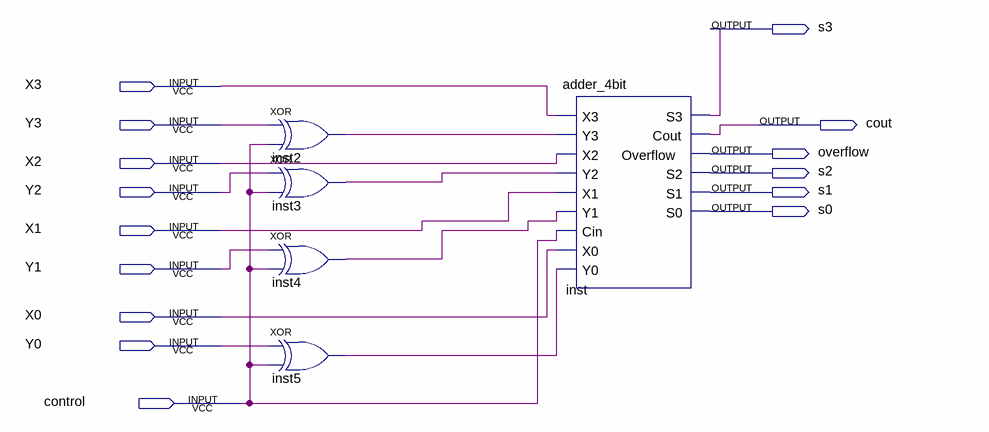
[diagram p0: schematic sheet]
// Quartus schematic lab07step0.bdf as structural Verilog: 5 symbols, 15 pins
module lab07step0 (
  input  X3,
  input  Y3,
  input  X2,
  input  Y2,
  input  X1,
  input  Y1,
  input  X0,
  input  Y0,
  input  control,
  output s3,
  output cout,
  output overflow,
  output s2,
  output s1,
  output s0
);

  wire inst2_out, inst3_out, inst4_out, inst5_out;

  xor inst2 (inst2_out, Y3, control);
  xor inst3 (inst3_out, Y2, control);
  xor inst4 (inst4_out, Y1, control);
  xor inst5 (inst5_out, Y0, control);
  adder_4bit inst (
    .X3(X3), .Y3(inst2_out), .X2(X2), .Y2(inst3_out), .X1(X1), .Y1(inst4_out), .Cin(control), .X0(X0),
    .Y0(inst5_out), .S3(s3), .Cout(cout), .Overflow(overflow), .S2(s2), .S1(s1), .S0(s0));
endmodule
